# EAGLE design quadcopter (EAGLE 7.6.0)
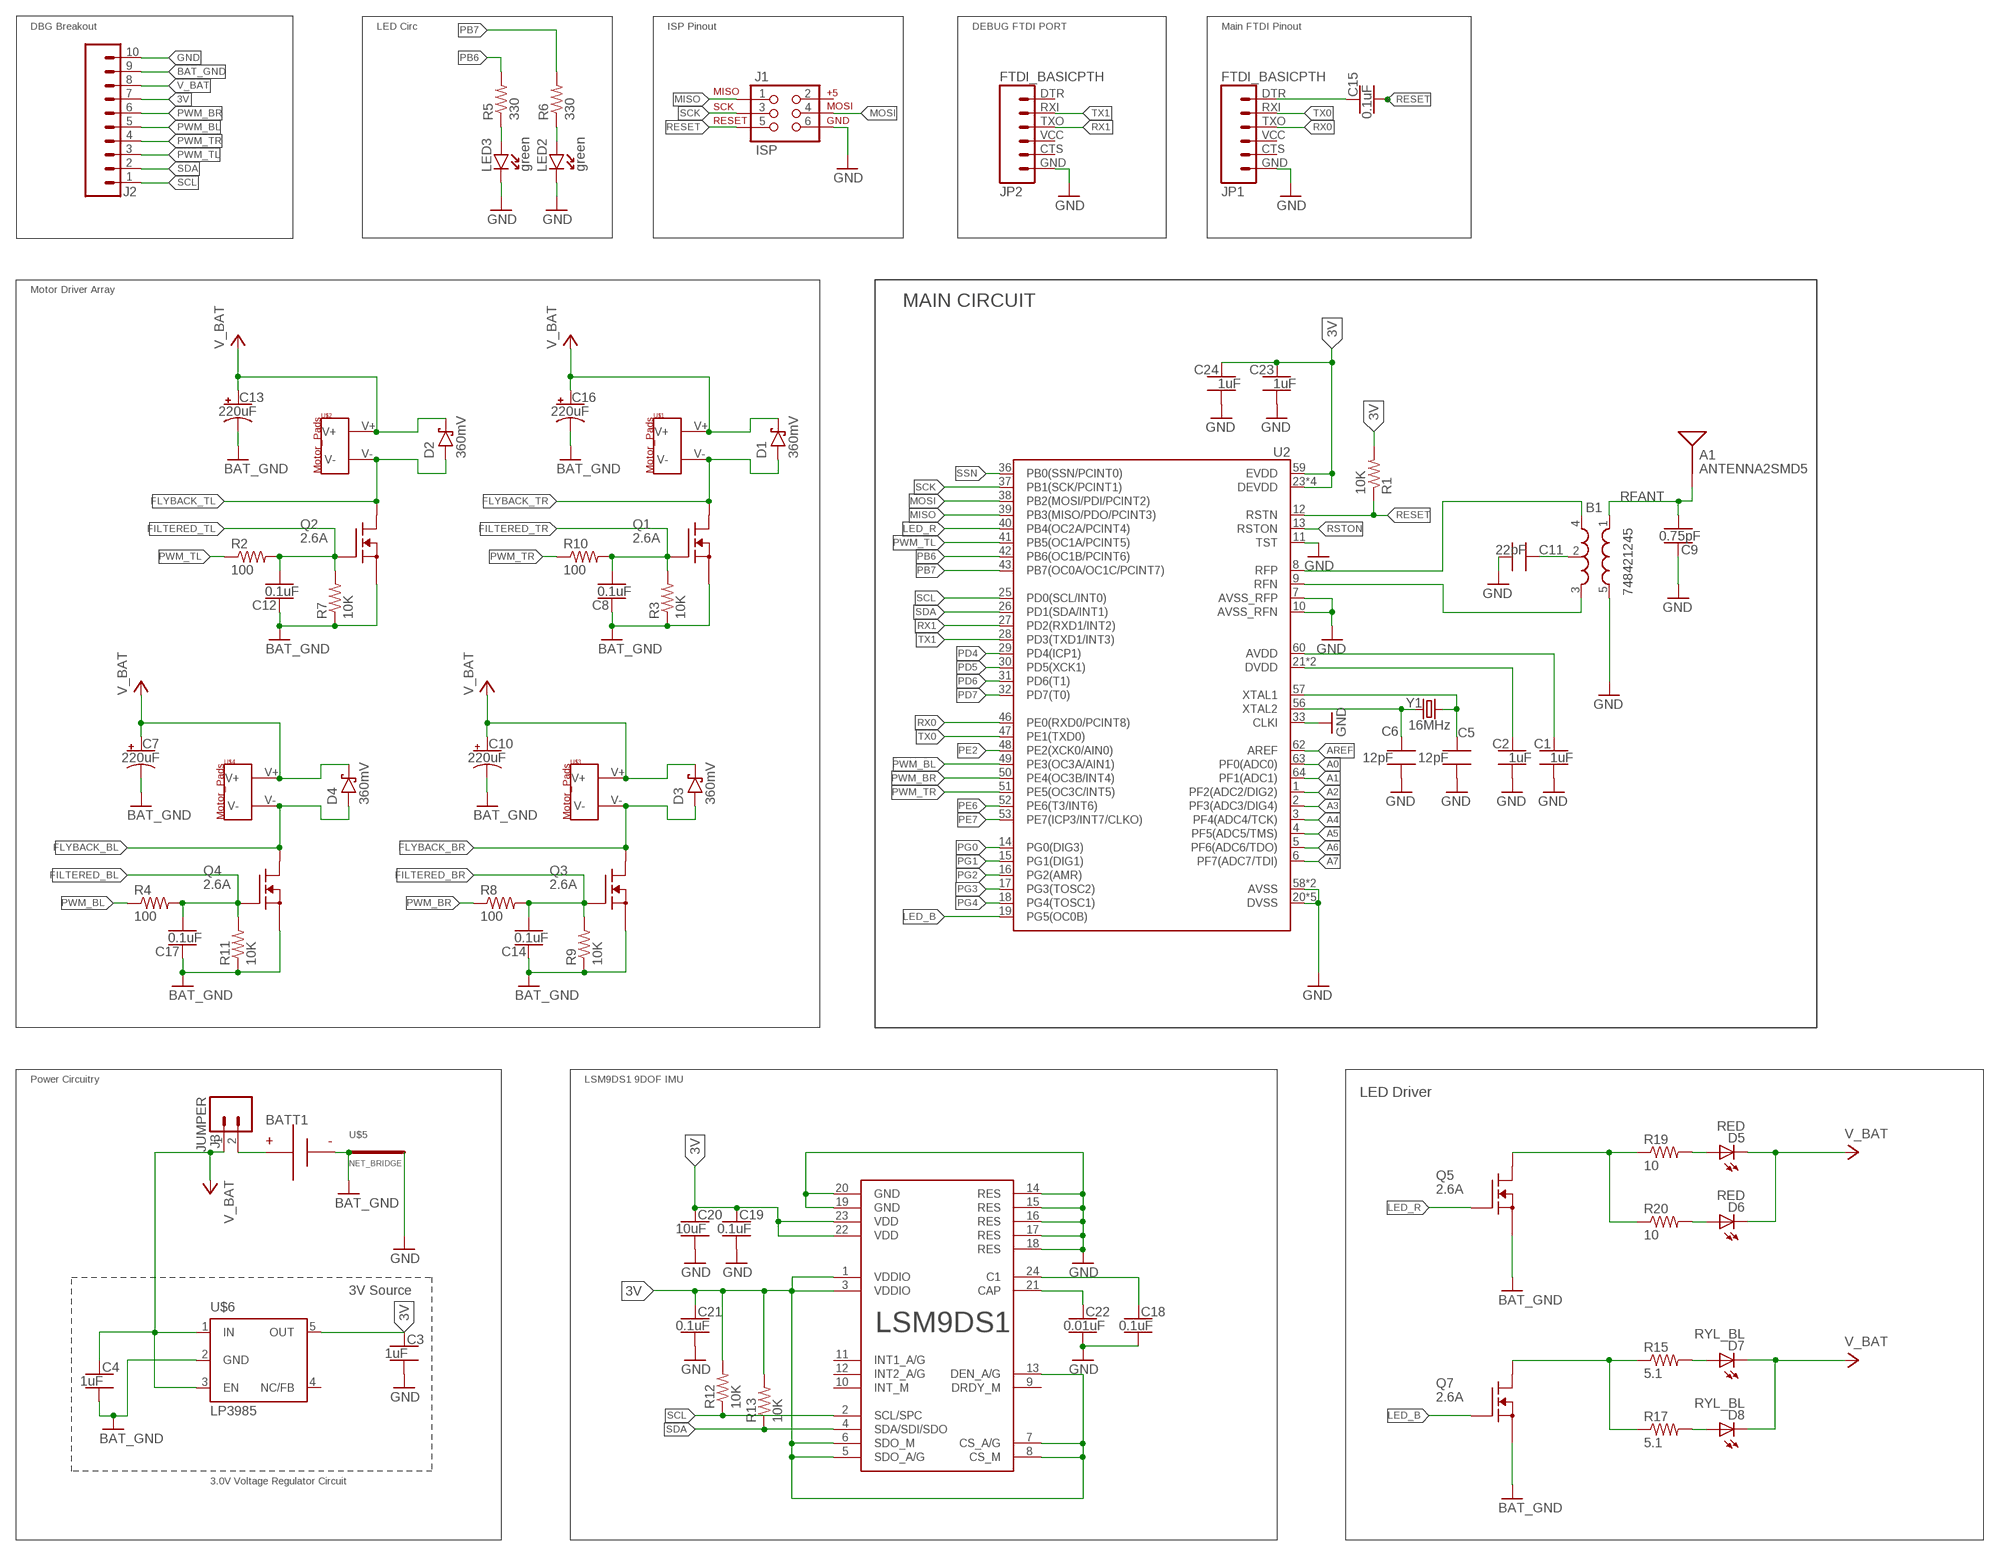
[diagram p0: schematic, sheet 1]

## Parts
A1  ANTENNA2SMD5  [ANTENNA-CHIP5]
B1  748421245  BALUN0805  [BALUN]
BATT1  BATTERY-HUBSAN-W/HOLDER  [BATTERY-W/HOLDER-380MAH-HUBSAN]
C1  1uF  CAPACITOR-NP_SMD-2012-0805_CERAMIC-1UF  [CAPC2012X140_HS]
C2  1uF  CAPACITOR-NP_SMD-2012-0805_CERAMIC-1UF  [CAPC2012X140_HS]
C3  1uF  CAPACITOR-NP_SMD-2012-0805_CERAMIC-1UF  [CAPC2012X140_HS]
C4  1uF  CAPACITOR-NP_SMD-2012-0805_CERAMIC-1UF  [CAPC2012X140_HS]
C5  12pF  CAPACITOR-NP_SMD-2012-0805_CERAMIC-12PF  [CAPC2012X140_HS]
C6  12pF  CAPACITOR-NP_SMD-2012-0805_CERAMIC-12PF  [CAPC2012X140_HS]
C7  220uF  CAPACITOR-POL_SMD-7043-D_TANTALUM-220UF  [CAPMP7343X310_HS]
C8  0.1uF  CAPACITOR-NP_SMD-2012-0805_CERAMIC-0.1UF  [CAPC2012X140_HS]
C9  0.75pF  CAPACITOR-NP_SMD-2012-0805_CERAMIC-0.75PF  [CAPC2012X140_HS]
C10  220uF  CAPACITOR-POL_SMD-7043-D_TANTALUM-220UF  [CAPMP7343X310_HS]
C11  22pF  CAPACITOR-NP_SMD-2012-0805_CERAMIC-22PF  [CAPC2012X140_HS]
C12  0.1uF  CAPACITOR-NP_SMD-2012-0805_CERAMIC-0.1UF  [CAPC2012X140_HS]
C13  220uF  CAPACITOR-POL_SMD-7043-D_TANTALUM-220UF  [CAPMP7343X310_HS]
C14  0.1uF  CAPACITOR-NP_SMD-2012-0805_CERAMIC-0.1UF  [CAPC2012X140_HS]
C15  0.1uF  CAPACITOR-NP_SMD-2012-0805_CERAMIC-0.1UF  [CAPC2012X140_HS]
C16  220uF  CAPACITOR-POL_SMD-7043-D_TANTALUM-220UF  [CAPMP7343X310_HS]
C17  0.1uF  CAPACITOR-NP_SMD-2012-0805_CERAMIC-0.1UF  [CAPC2012X140_HS]
C18  0.1uF  CAPACITOR-NP_SMD-2012-0805_CERAMIC-0.1UF  [CAPC2012X140_HS]
C19  0.1uF  CAPACITOR-NP_SMD-2012-0805_CERAMIC-0.1UF  [CAPC2012X140_HS]
C20  10uF  CAPACITOR-NP_SMD-2012-0805_CERAMIC-10UF  [CAPC2012X140_HS]
C21  0.1uF  CAPACITOR-NP_SMD-2012-0805_CERAMIC-0.1UF  [CAPC2012X140_HS]
C22  0.01uF  CAPACITOR-NP_SMD-2012-0805_CERAMIC-0.01UF  [CAPC2012X140_HS]
C23  1uF  CAPACITOR-NP_SMD-2012-0805_CERAMIC-1UF  [CAPC2012X140_HS]
C24  1uF  CAPACITOR-NP_SMD-2012-0805_CERAMIC-1UF  [CAPC2012X140_HS]
D1  360mV  DIODE-SCHOTTKY_SMD-SOD123-360MV  [SOD3716X135_HS]
D2  360mV  DIODE-SCHOTTKY_SMD-SOD123-360MV  [SOD3716X135_HS]
D3  360mV  DIODE-SCHOTTKY_SMD-SOD123-360MV  [SOD3716X135_HS]
D4  360mV  DIODE-SCHOTTKY_SMD-SOD123-360MV  [SOD3716X135_HS]
D5  RED  XQ-A-LED-RED-1616  [XQ-A-1616]
D6  RED  XQ-A-LED-RED-1616  [XQ-A-1616]
D7  RYL_BL  XQ-A-LED-RYL-BL-1616  [XQ-A-1616]
D8  RYL_BL  XQ-A-LED-RYL-BL-1616  [XQ-A-1616]
J1  ISP  AVR_SPI_PRG_6NS  [2X3-NS]
J2  SIP-10_TH-254X10  [HDRV10W63P254_10X1_2540X254H838_HS]
J3  JUMPER  MALE_HEADER_2POS-2X1-0.1IN  [MALE_HEADER_2X1_0.1IN]
JP1  FTDI_BASICPTH  [FTDI_BASIC]
JP2  FTDI_BASICPTH  [FTDI_BASIC]
LED2  green  DIODE-LED_SMD-2012-0805-GREEN  [LEDSC125X200X120-2_HS]
LED3  green  DIODE-LED_SMD-2012-0805-GREEN  [LEDSC125X200X120-2_HS]
LSM9DS1  LSM9DS1_IMU  [LSM9DS1_LGA24L]
Q1  2.6A  NMOS-SI2302CDS  [SOT-23]
Q2  2.6A  NMOS-SI2302CDS  [SOT-23]
Q3  2.6A  NMOS-SI2302CDS  [SOT-23]
Q4  2.6A  NMOS-SI2302CDS  [SOT-23]
Q5  2.6A  NMOS-SI2302CDS  [SOT-23]
Q7  2.6A  NMOS-SI2302CDS  [SOT-23]
R1  10K  RESISTOR_SMD-2012-0805-10K  [RESC2012X60_HS]
R2  100  RESISTOR_SMD-2012-0805-100  [RESC2012X60_HS]
R3  10K  RESISTOR_SMD-2012-0805-10K  [RESC2012X60_HS]
R4  100  RESISTOR_SMD-2012-0805-100  [RESC2012X60_HS]
R5  330  RESISTOR_SMD-2012-0805-330  [RESC2012X60_HS]
R6  330  RESISTOR_SMD-2012-0805-330  [RESC2012X60_HS]
R7  10K  RESISTOR_SMD-2012-0805-10K  [RESC2012X60_HS]
R8  100  RESISTOR_SMD-2012-0805-100  [RESC2012X60_HS]
R9  10K  RESISTOR_SMD-2012-0805-10K  [RESC2012X60_HS]
R10  100  RESISTOR_SMD-2012-0805-100  [RESC2012X60_HS]
R11  10K  RESISTOR_SMD-2012-0805-10K  [RESC2012X60_HS]
R12  10K  RESISTOR_SMD-2012-0805-10K  [RESC2012X60_HS]
R13  10K  RESISTOR_SMD-2012-0805-10K  [RESC2012X60_HS]
R15  5.1  RESISTOR-ERJ-6D-5.1  [PSC_RESIST_805_LR]
R17  5.1  RESISTOR-ERJ-6D-5.1  [PSC_RESIST_805_LR]
R19  10  RESISTOR-ERJ-PO6-10  [PSC_RESIST_805]
R20  10  RESISTOR-ERJ-PO6-10  [PSC_RESIST_805]
U2  ATMEGA128RFA1  [QFN-64]
U$1  MOTOR_PADS  [MOTOR_PADS]
U$2  MOTOR_PADS  [MOTOR_PADS]
U$3  MOTOR_PADS  [MOTOR_PADS]
U$4  MOTOR_PADS  [MOTOR_PADS]
U$5  NET_BRIDGE  [NET_BRIDGE]
U$6  LP3985  TPS73633-DBVT  [SOT23-DBV]
Y1  16MHz  CRYSTAL5X3  [CRYSTAL-SMD-5X3]

## Nets
3V: C3.1 C19.1 C20.1 C21.1 C23.1 C24.1 J2.7 LSM9DS1.1(VDDIO) LSM9DS1.3(VDDIO) LSM9DS1.5(SDO_A/G) LSM9DS1.6(SDO_M) LSM9DS1.7(CS_A/G) LSM9DS1.8(CS_M) LSM9DS1.13(DEN_A/G) LSM9DS1.22(VDD) LSM9DS1.23(VDD) R1.2 R12.2 R13.2 U2.23(DEVDD) U2.34(DEVDD) U2.44(DEVDD) U2.54(DEVDD) U2.59(EVDD) U$6.5(OUT)
A0: U2.63(PF0(ADC0))
A1: U2.64(PF1(ADC1))
A2: U2.1(PF2(ADC2/DIG2))
A3: U2.2(PF3(ADC3/DIG4))
A4: U2.3(PF4(ADC4/TCK))
A5: U2.4(PF5(ADC5/TMS))
A6: U2.5(PF6(ADC6/TDO))
A7: U2.6(PF7(ADC7/TDI))
AREF: U2.62(AREF)
AVDD: C1.1 U2.60(AVDD)
BAT_GND [HIGHCURRENT]: BATT1.-(N) C4.2 C7.2(-) C8.1 C10.2(-) C12.1 C13.2(-) C14.1 C16.2(-) C17.1 J2.9 Q1.S Q2.S Q3.S Q4.S Q5.S Q7.S R3.1 R7.1 R9.1 R11.1 U$5.P$1 U$6.2(GND)
DTR: C15.1 JP1.DTR
DVDD: C2.1 U2.21(DVDD) U2.22(DVDD)
FILTERED_BL: C17.2 Q4.G R4.2 R11.2
FILTERED_BR: C14.2 Q3.G R8.2 R9.2
FILTERED_TL: C12.2 Q2.G R2.2 R7.2
FILTERED_TR: C8.2 Q1.G R3.2 R10.2
FLYBACK_BL [HIGHCURRENT]: D4.A Q4.D U$4.V-
FLYBACK_BR [HIGHCURRENT]: D3.A Q3.D U$3.V-
FLYBACK_TL [HIGHCURRENT]: D2.A Q2.D U$2.V-
FLYBACK_TR [HIGHCURRENT]: D1.A Q1.D U$1.V-
GND: B1.5(GND) C1.2 C2.2 C3.2 C5.2 C6.2 C9.1 C11.2 C18.2 C19.2 C20.2 C21.2 C22.2 C23.2 C24.2 J1.6 J2.10 JP1.GND JP2.GND LED2.C LED3.C LSM9DS1.14(RES) LSM9DS1.15(RES) LSM9DS1.16(RES) LSM9DS1.17(RES) LSM9DS1.18(RES) LSM9DS1.19(GND) LSM9DS1.20(GND) U2.7(AVSS_RFP) U2.10(AVSS_RFN) U2.11(TST) U2.20(DVSS) U2.24(DVSS) U2.33(CLKI) U2.35(DVSS) U2.45(DVSS) U2.55(DVSS) U2.58(AVSS) U2.61(AVSS) U$5.P$2
LED_B: Q7.G U2.19(PG5(OC0B))
LED_R: Q5.G U2.40(PB4(OC2A/PCINT4))
MISO: J1.1 U2.39(PB3(MISO/PDO/PCINT3))
MOSI: J1.4 U2.38(PB2(MOSI/PDI/PCINT2))
N$2 [HIGHCURRENT]: BATT1.+(P) J3.2
N$3: C5.1 U2.57(XTAL1) Y1.3
N$4: C6.1 U2.56(XTAL2) Y1.1
N$5: C18.1 LSM9DS1.24(C1)
N$6 [HIGHCURRENT]: Q5.D R19.P$1 R20.P$1
N$7: B1.2(GND) C11.1
N$8: LED3.A R5.1
N$9: C22.1 LSM9DS1.21(CAP)
N$10 [HIGHCURRENT]: Q7.D R15.P$1 R17.P$1
N$11 [HIGHCURRENT]: D5.A R19.P$2
N$12 [HIGHCURRENT]: D6.A R20.P$2
N$13: LED2.A R6.1
N$15 [HIGHCURRENT]: D7.A R15.P$2
N$16 [HIGHCURRENT]: D8.A R17.P$2
PB6: R5.2 U2.42(PB6(OC1B/PCINT6))
PB7: R6.2 U2.43(PB7(OC0A/OC1C/PCINT7))
PD4: U2.29(PD4(ICP1))
PD5: U2.30(PD5(XCK1))
PD6: U2.31(PD6(T1))
PD7: U2.32(PD7(T0))
PE2: U2.48(PE2(XCK0/AIN0))
PE6: U2.52(PE6(T3/INT6))
PE7: U2.53(PE7(ICP3/INT7/CLKO))
PG0: U2.14(PG0(DIG3))
PG1: U2.15(PG1(DIG1))
PG2: U2.16(PG2(AMR))
PG3: U2.17(PG3(TOSC2))
PG4: U2.18(PG4(TOSC1))
PWM_BL: J2.5 R4.1 U2.49(PE3(OC3A/AIN1))
PWM_BR: J2.6 R8.1 U2.50(PE4(OC3B/INT4))
PWM_TL: J2.3 R2.1 U2.41(PB5(OC1A/PCINT5))
PWM_TR: J2.4 R10.1 U2.51(PE5(OC3C/INT5))
RESET: C15.2 J1.5 R1.1 U2.12(RSTN)
RFANT [RFSIG]: A1.FEED(SIGNAL) B1.1(IN) C9.2
RFN: B1.3(OUT2) U2.9(RFN)
RFP: B1.4(OUT1) U2.8(RFP)
RSTON: U2.13(RSTON)
RX0: JP1.TXO U2.46(PE0(RXD0/PCINT8))
RX1: JP2.TXO U2.27(PD2(RXD1/INT2))
SCK: J1.3 U2.37(PB1(SCK/PCINT1))
SCL: J2.1 LSM9DS1.2(SCL/SPC) R12.1 U2.25(PD0(SCL/INT0))
SDA: J2.2 LSM9DS1.4(SDA/SDI/SDO) R13.1 U2.26(PD1(SDA/INT1))
SSN: U2.36(PB0(SSN/PCINT0))
TX0: JP1.RXI U2.47(PE1(TXD0))
TX1: JP2.RXI U2.28(PD3(TXD1/INT3))
V_BAT [HIGHCURRENT]: C4.1 C7.1(+) C10.1(+) C13.1(+) C16.1(+) D1.C D2.C D3.C D4.C D5.C D6.C D7.C D8.C J2.8 J3.1 U$1.V+ U$2.V+ U$3.V+ U$4.V+ U$6.1(IN) U$6.3(EN)
Unconnected: J1.2 JP1.CTS JP1.VCC JP2.CTS JP2.DTR JP2.VCC LSM9DS1.9(DRDY_M) LSM9DS1.10(INT_M) LSM9DS1.11(INT1_A/G) LSM9DS1.12(INT2_A/G) U$6.4(NC/FB)

## Notes on the sheet
- DBG Breakout | LED Circ | ISP Pinout | DEBUG FTDI PORT | Main FTDI Pinout
- Motor Driver Array
- MAIN CIRCUIT
- Power Circuitry | LSM9DS1 9DOF IMU
- LED Driver
- 3V Source
- 3.0V Voltage Regulator Circuit

## Library data of the parts
A1 = quadparts_prebuilt:ANTENNA2: Chip antenna Single endded antenna. Common with smaller chip antennas. CHIP4 package is the GPS Chip Antenna SKU: GPS-08418. CHIP5 package is 2.4GHz chip antenna SKU: WRL-00144.; DATASHEET: http://www.linxtechnologies.com/resources/data-guides/ant-xxx-chp-x.pdf; DIST: Digikey; DISTPN: ANT-2.45-CHPCT-ND; MFR: Linx Technologies Inc.; MPN: ANT-2.45-CHP-T; PRICE: 3.16
B1 = quadparts_prebuilt:BALUN: 0805 footprint balun- Ember 351/357; DATASHEET: http://katalog.we-online.de/pbs/datasheet/748421245.pdf; DIST: Digikey; DISTPN: 732-2230-6-ND; MFR: Wurth Electronics Inc; MPN: 748421245; PRICE: 2.63
BATT1 = quadparts_prebuilt:BATTERY; CREATOR: Swanson; DIST: AMAZON; DISTPN: http://www.amazon.com/dp/B00RROB6Q4?smid=AMNTPWSAB5H0S; MFR: HUBSAN; MPN: X4-H107C-8-in-1
C1-C4 C23 C24 = quadparts_prebuilt:CAPACITOR-NP_: Nonpolarized capacitor; DIST: Digikey; DISTPN: 490-4736-1-ND; MFR: Murata Electronics North America; MPN: GRM21BR71H105KA12L
C5 C6 = quadparts_prebuilt:CAPACITOR-NP_: Nonpolarized capacitor; DIST: Digikey; DISTPN: 490-5531-1-ND; MFR: Murata Electronics North America; MPN: GRM21A5C2E120JW01D
C7 C10 C13 C16 = quadparts_prebuilt:CAPACITOR-POL_: Polarized capacitor; DIST: Digikey; DISTPN: 478-8912-1-ND; MFR: AVX Corporation; MPN: TAJD227K006RNJ
C8 C12 C14 C15 C17-C19 C21 = quadparts_prebuilt:CAPACITOR-NP_: Nonpolarized capacitor; DIST: Digikey; DISTPN: 490-1666-1-ND; MFR: Murata Electronics North America; MPN: GRM21BR71H104KA01L
C9 = quadparts_prebuilt:CAPACITOR-NP_: Nonpolarized capacitor; DIST: Digikey; DISTPN: 490-3585-1-ND; MFR: Murata Electronics North America; MPN: GQM2195C2AR75CB01D
C11 = quadparts_prebuilt:CAPACITOR-NP_: Nonpolarized capacitor; DIST: Digikey; DISTPN: 490-5534-1-ND; MFR: Murata Electronics North America; MPN: GRM21A5C2E220JW01D
C20 = quadparts_prebuilt:CAPACITOR-NP_: Nonpolarized capacitor; DIST: Digikey; DISTPN: 490-5523-1-ND; MFR: Murata Electronics North America; MPN: GRM21BR61E106KA73L
C22 = quadparts_prebuilt:CAPACITOR-NP_: Nonpolarized capacitor; DIST: Digikey; DISTPN: 490-8295-1-ND; MFR: Murata Electronics North America; MPN: GRM2195C1H103FA01D
D1-D4 = quadparts_prebuilt:DIODE-SCHOTTKY_: Schottky diode; DIST: Digikey; DISTPN: CRS08QMCT-ND; MFR: Toshiba Semiconductor and Storage; MPN: CRS08(TE85L,Q,M)
D5 D6 = LEDS:XQ-A-LED: Standard LED Packages; CREATOR: BRIAN; DIST: Digikey; DISTPN: XQARED-02-0000-000000W01CT-ND; MFR: Cree_Inc.; MPN: XQARED-02-0000-000000W01
D7 D8 = LEDS:XQ-A-LED: Standard LED Packages; CREATOR: BRIAN; DIST: Digikey; DISTPN: XQAROY-02-0000-000000601CT-ND; MFR: Cree_Inc.; MPN: XQAROY-02-0000-000000601
J1 = quadparts_prebuilt:AVR_SPI_PRG_6: AVR ISP 6 Pin This is the reduced ISP connector for AVR programming. Common on Arduino. This footprint will take up less PCB space and can be used with a 10-pin to 6-pin adapter such as SKU: BOB-08508; DATASHEET: http://portal.fciconnect.com/Comergent//fci/drawing/67996.pdf; DIST: Digikey; DISTPN: 609-3234-ND; MFR: Amphenol FCI; MPN: 67997-206HLF; PRICE: 0.31
J2 = quadparts_prebuilt:SIP-10_: 10 pin single inline pin header, socket, or connector; DATASHEET: http://portal.fciconnect.com/Comergent//fci/drawing/68000.pdf; DIST: Digikey; DISTPN: 609-3250-ND; MFR: Amphenol FCI; MPN: 68000-110HLF; PRICE: 0.55
J3 = quadparts:MALE_HEADER_2POS: 2 pin single inline pin header, socket, or connector; CREATOR: SWANSON; DIST: Digikey; DISTPN: 3M9447-ND; MFR: 3M; MPN: 961102-6404-AR
JP1 JP2 = quadparts_prebuilt:FTDI_BASIC: FTDI Basic header with labels; DATASHEET: http://portal.fciconnect.com/Comergent//fci/drawing/68015.pdf; DIST: Digikey; DISTPN: 609-3327-ND; MFR: Amphenol FCI; MPN: 68016-406HLF; PRICE: 0.33
LED2 LED3 = quadparts_prebuilt:DIODE-LED_: Light emitting diode; DIST: Digikey; DISTPN: 160-1179-1-ND; MFR: Lite-On Inc; MPN: LTST-C170GKT
LSM9DS1 = quadparts:LSM9DS1_IMU: iNEMO IMU; CREATOR: BRIAN; DIST: Digikey; DISTPN: 497-14946-1-ND; MFR: STMicroelectronics; MPN: LSM9DS1TR
Q1-Q5 Q7 = quadparts:NMOS: Vishay NMOS; CREATOR: BRIAN; DIST: Digikey; DISTPN: SI2302CDS-T1-E3CT-ND; MFR: Vishay Siliconix; MPN: SI2302CDS-T1-E3
R1 R3 R7 R9 R11-R13 = quadparts_prebuilt:RESISTOR_: Resistor; DIST: Digikey; DISTPN: 311-10KARCT-ND; MFR: Yageo; MPN: RC0805JR-0710KL
R2 R4 R8 R10 = quadparts_prebuilt:RESISTOR_: Resistor; DIST: Digikey; DISTPN: 311-100ARCT-ND; MFR: Yageo; MPN: RC0805JR-07100RL
R5 R6 = quadparts_prebuilt:RESISTOR_: Resistor; DIST: Digikey; DISTPN: 311-330ARCT-ND; MFR: Yageo; MPN: RC0805JR-07330RL
R15 R17 = quadparts:RESISTOR: General Resistors; CREATOR: BRIAN; DIST: Digikey; DISTPN: P19237CT-ND; MFR: Panasonic; MPN: ERJ-6DQJ5R1V
R19 R20 = quadparts:RESISTOR: General Resistors; CREATOR: BRIAN; DIST: Digikey; DISTPN: P10ADCT-ND; MFR: Panasonic; MPN: ERJ-P06J100V
U2 = quadparts_prebuilt:ATMEGA128RFA1: ATmega128RFA1 8-bit AVR Microcontroller with Low Power 2.4GHz Transceiver for ZigBee and IEEE 802.15.4; CREATOR: Swanson; DATASHEET: http://www.atmel.com/Images/Atmel-8266-MCU_Wireless-ATmega128RFA1_Datasheet.pdf; DIST: Digikey; DISTPN: ATMEGA128RFA1-ZUR00DKR-ND; MFR: Atmel; MPN: ATMEGA128RFA1-ZUR00; PRICE: 10.21
U$1-U$4 = quadparts_prebuilt:MOTOR_PADS; DIST: NA; DISTPN: NA; MFR: NA; MPN: NA
U$5 = quadparts:NET_BRIDGE: Used to bridge two connections without the use of a zero-ohm resistor. This model has no tStop objects, so the mask will be placed on top.; CREATOR: BRIAN; DIST: ''; DISTPN: ''; MFR: ''; MPN: ''
U$6 = quadparts_prebuilt:TPS73633-DBVT; DATASHEET: http://www.ti.com/lit/ds/symlink/lp3985.pdf; DIST: Digikey; DISTPN: LP3985IM5X-3.0/NOPBCT-ND; MFR: Texas Instruments; MPN: LP3985IM5X-3.0/NOPB; PRICE: 0.59
Y1 = quadparts_prebuilt:CRYSTAL: Various standard crystals. Proven footprints.; DATASHEET: http://www.abracon.com/Resonators/abm3b.pdf; DIST: Digikey; DISTPN: 535-9122-1-ND; MFR: Abracon LLC; MPN: ABM3B-16.000MHZ-B2-T; PRICE: 0.68; PROD_ID: XTAL-08218

## Net classes
1 RFSIG: width 0.457 mm
2 HIGHCURRENT: width 0.457 mm

## Board
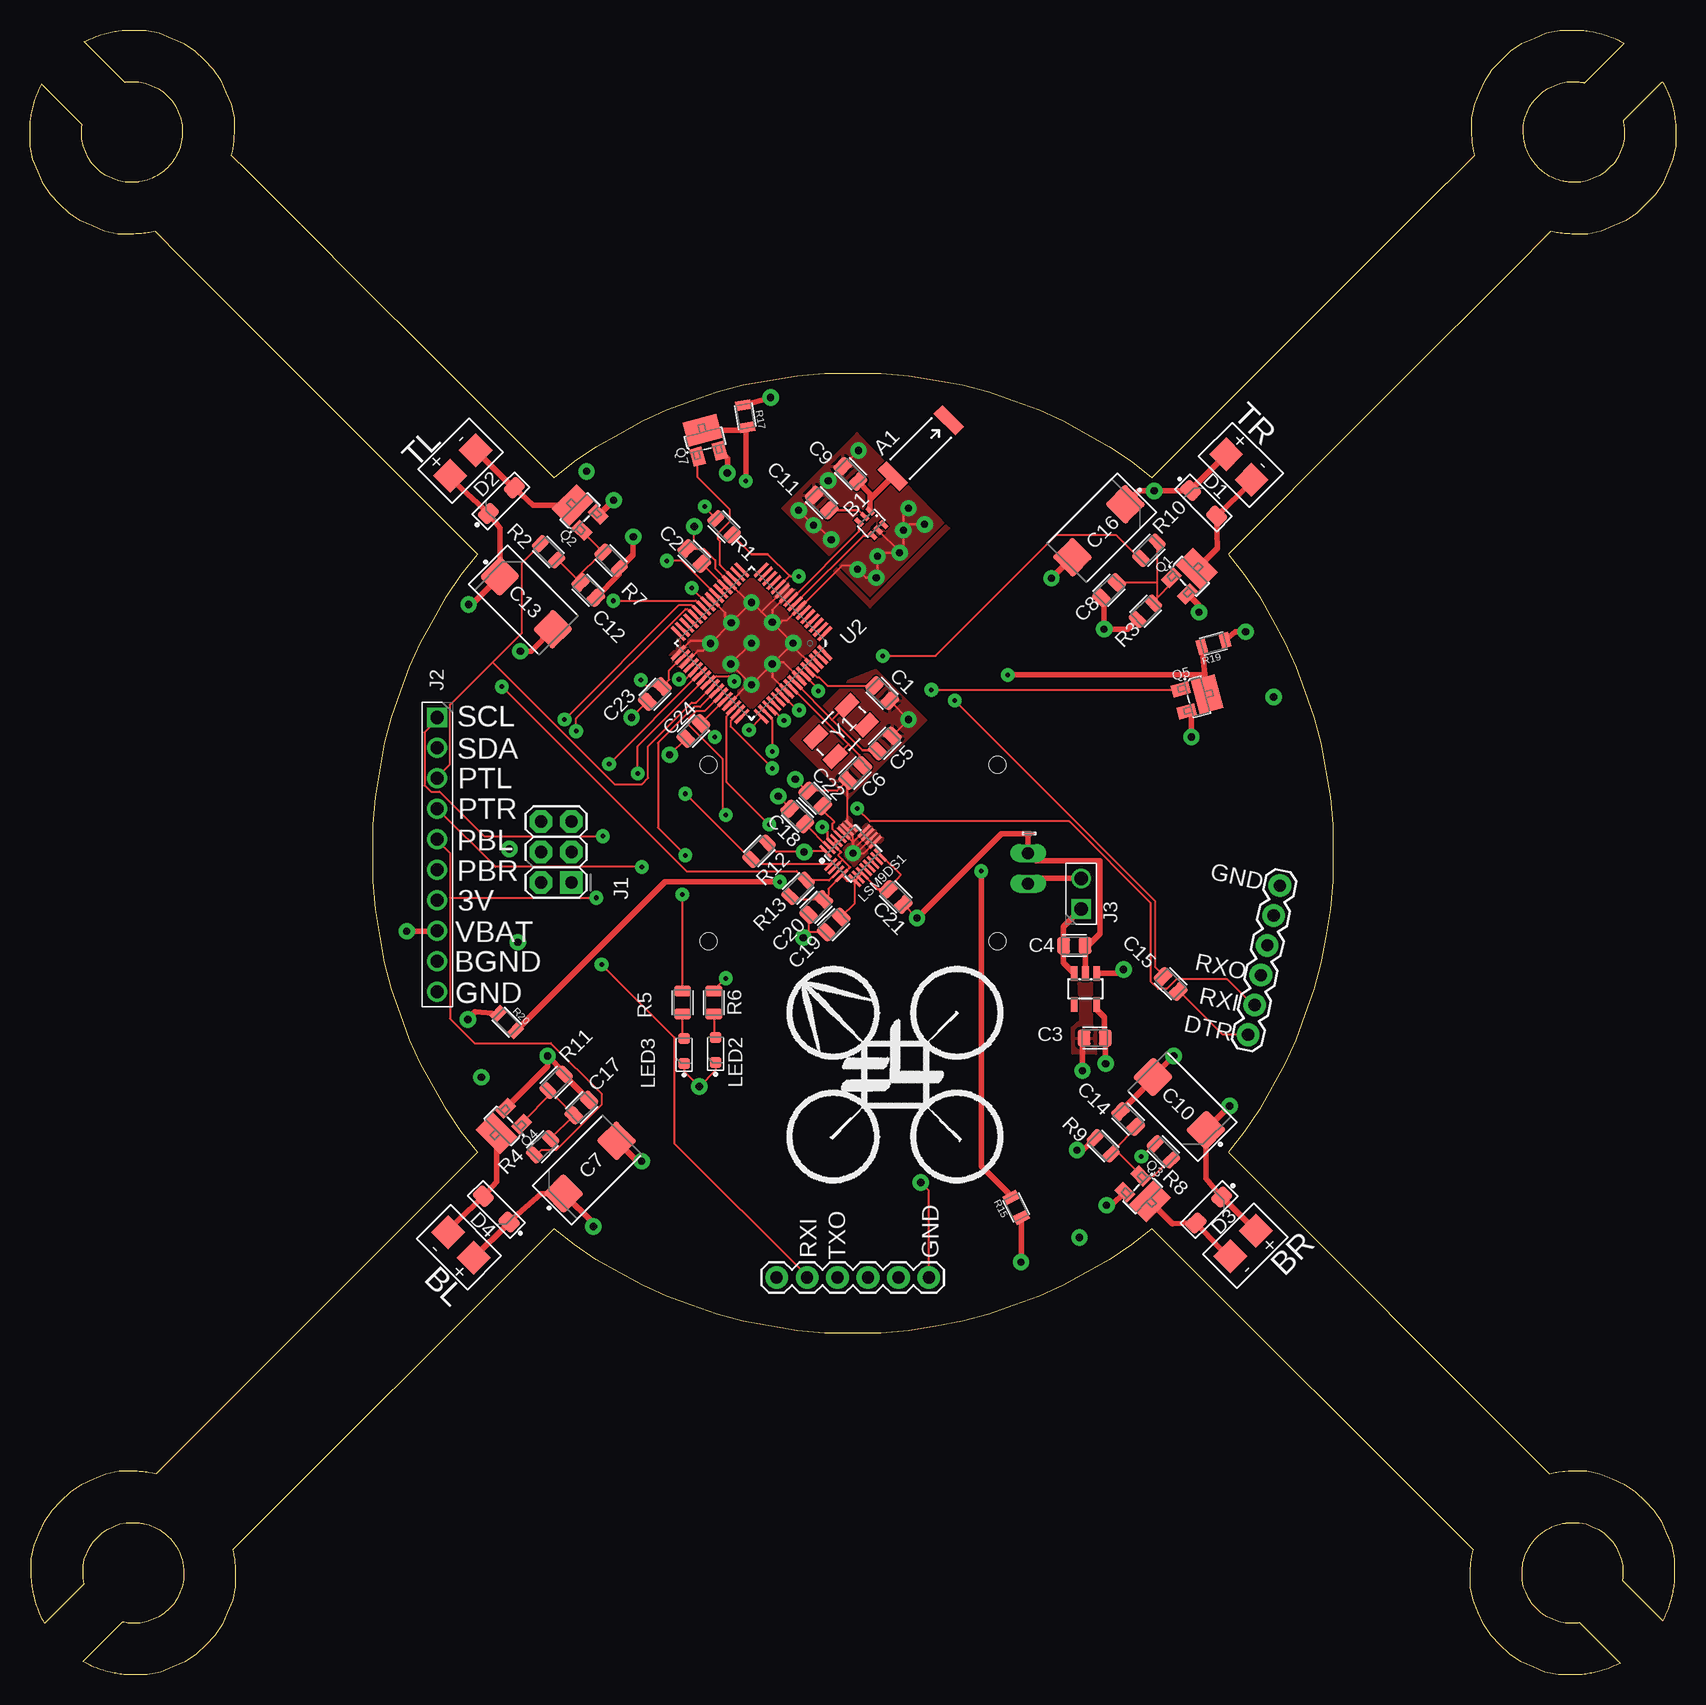
[diagram p1: board, top side]
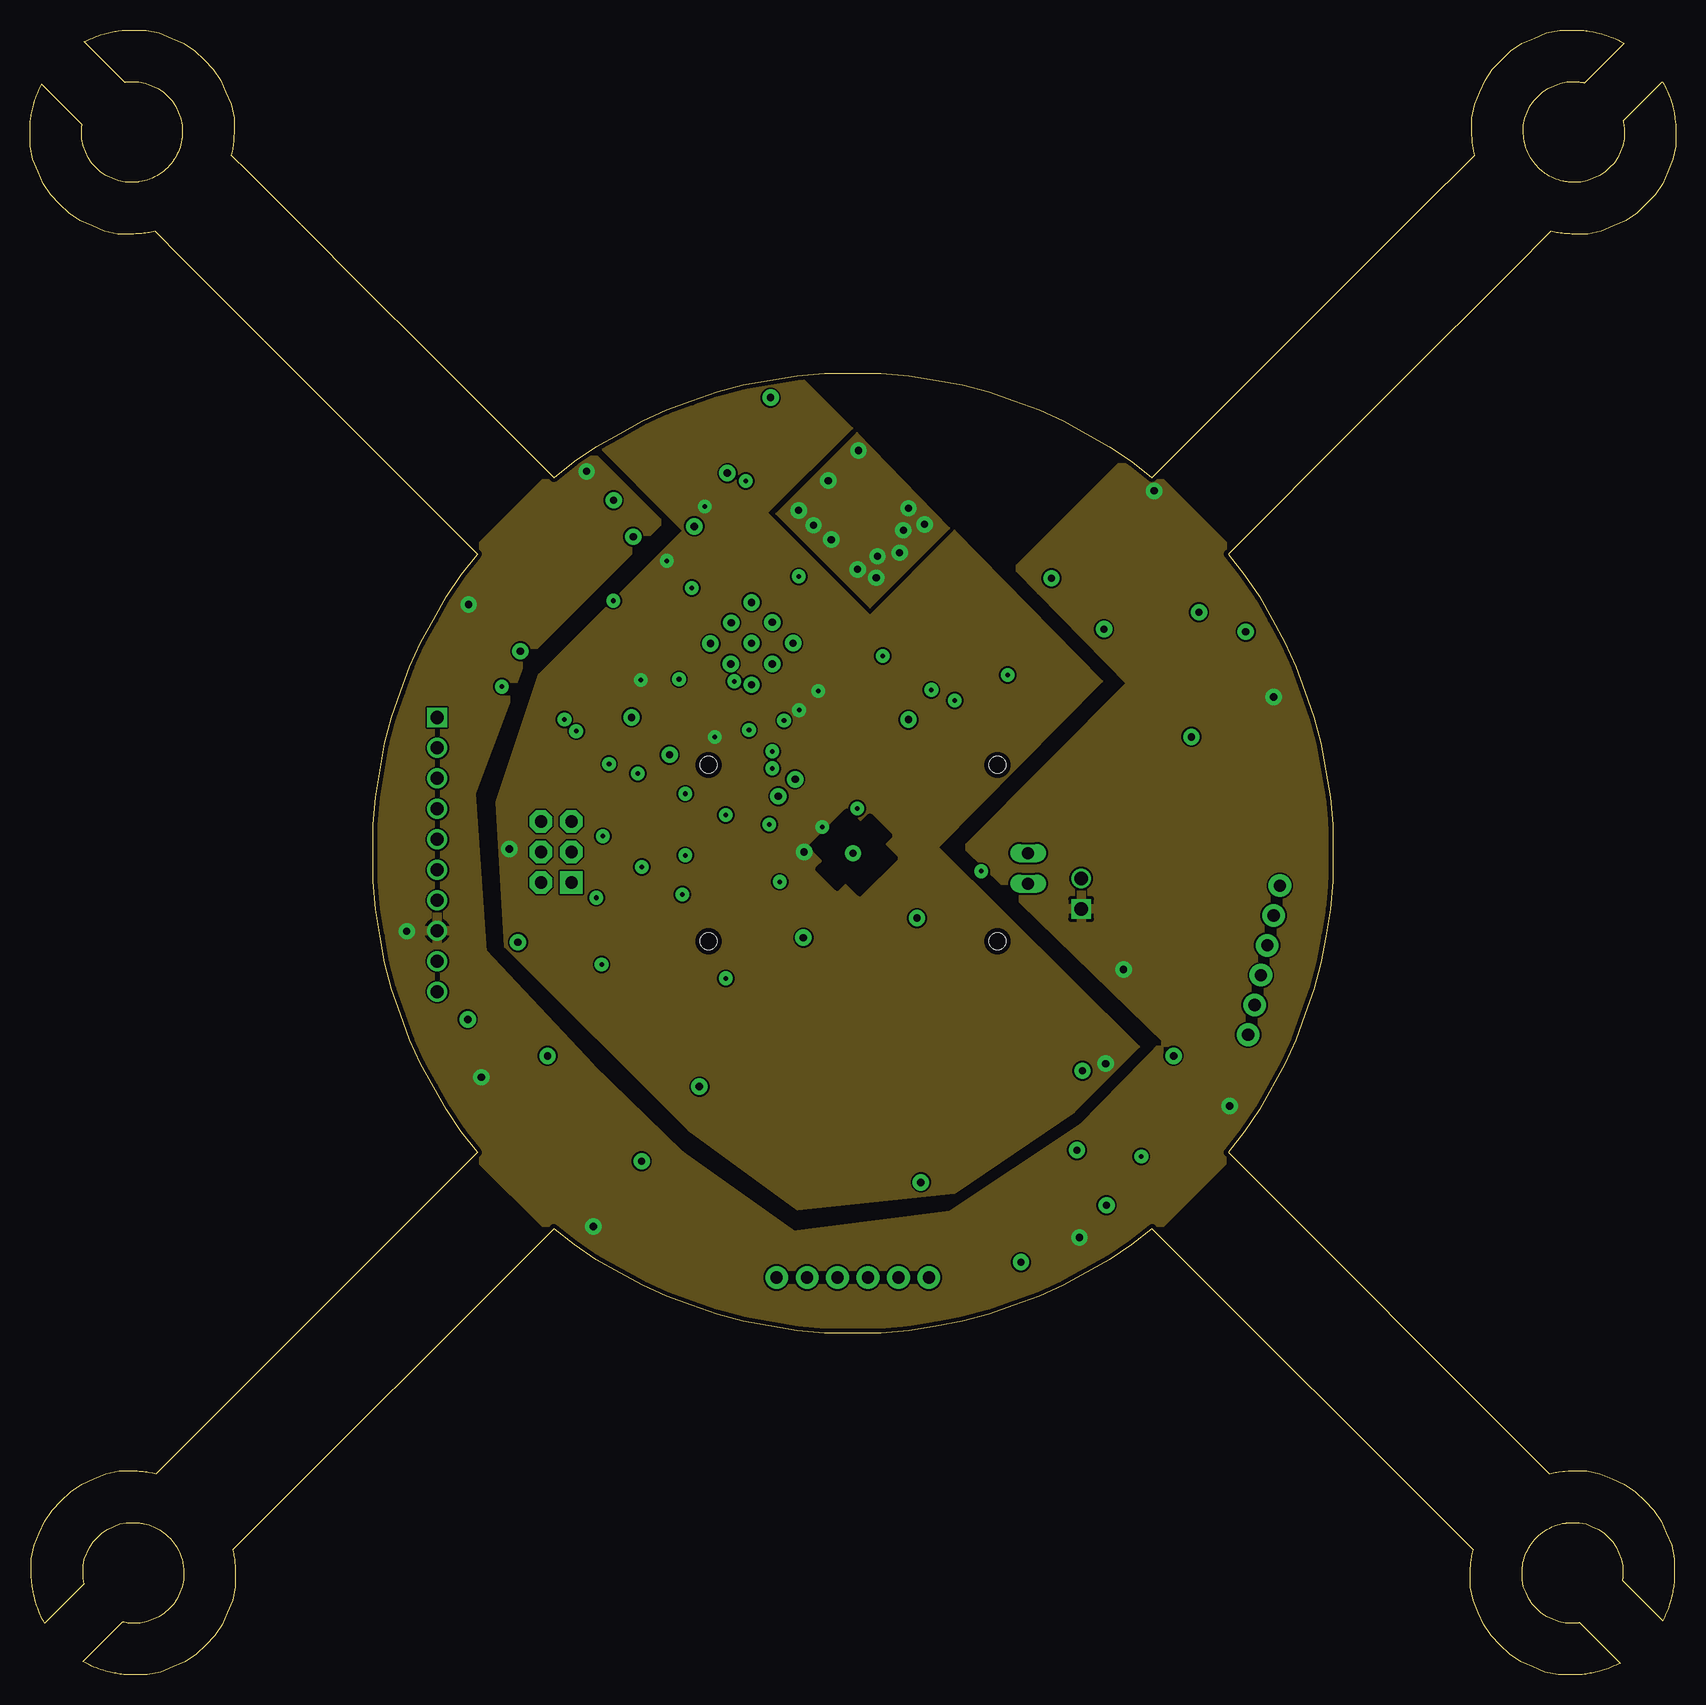
[diagram p2: board, inner layer Route2]
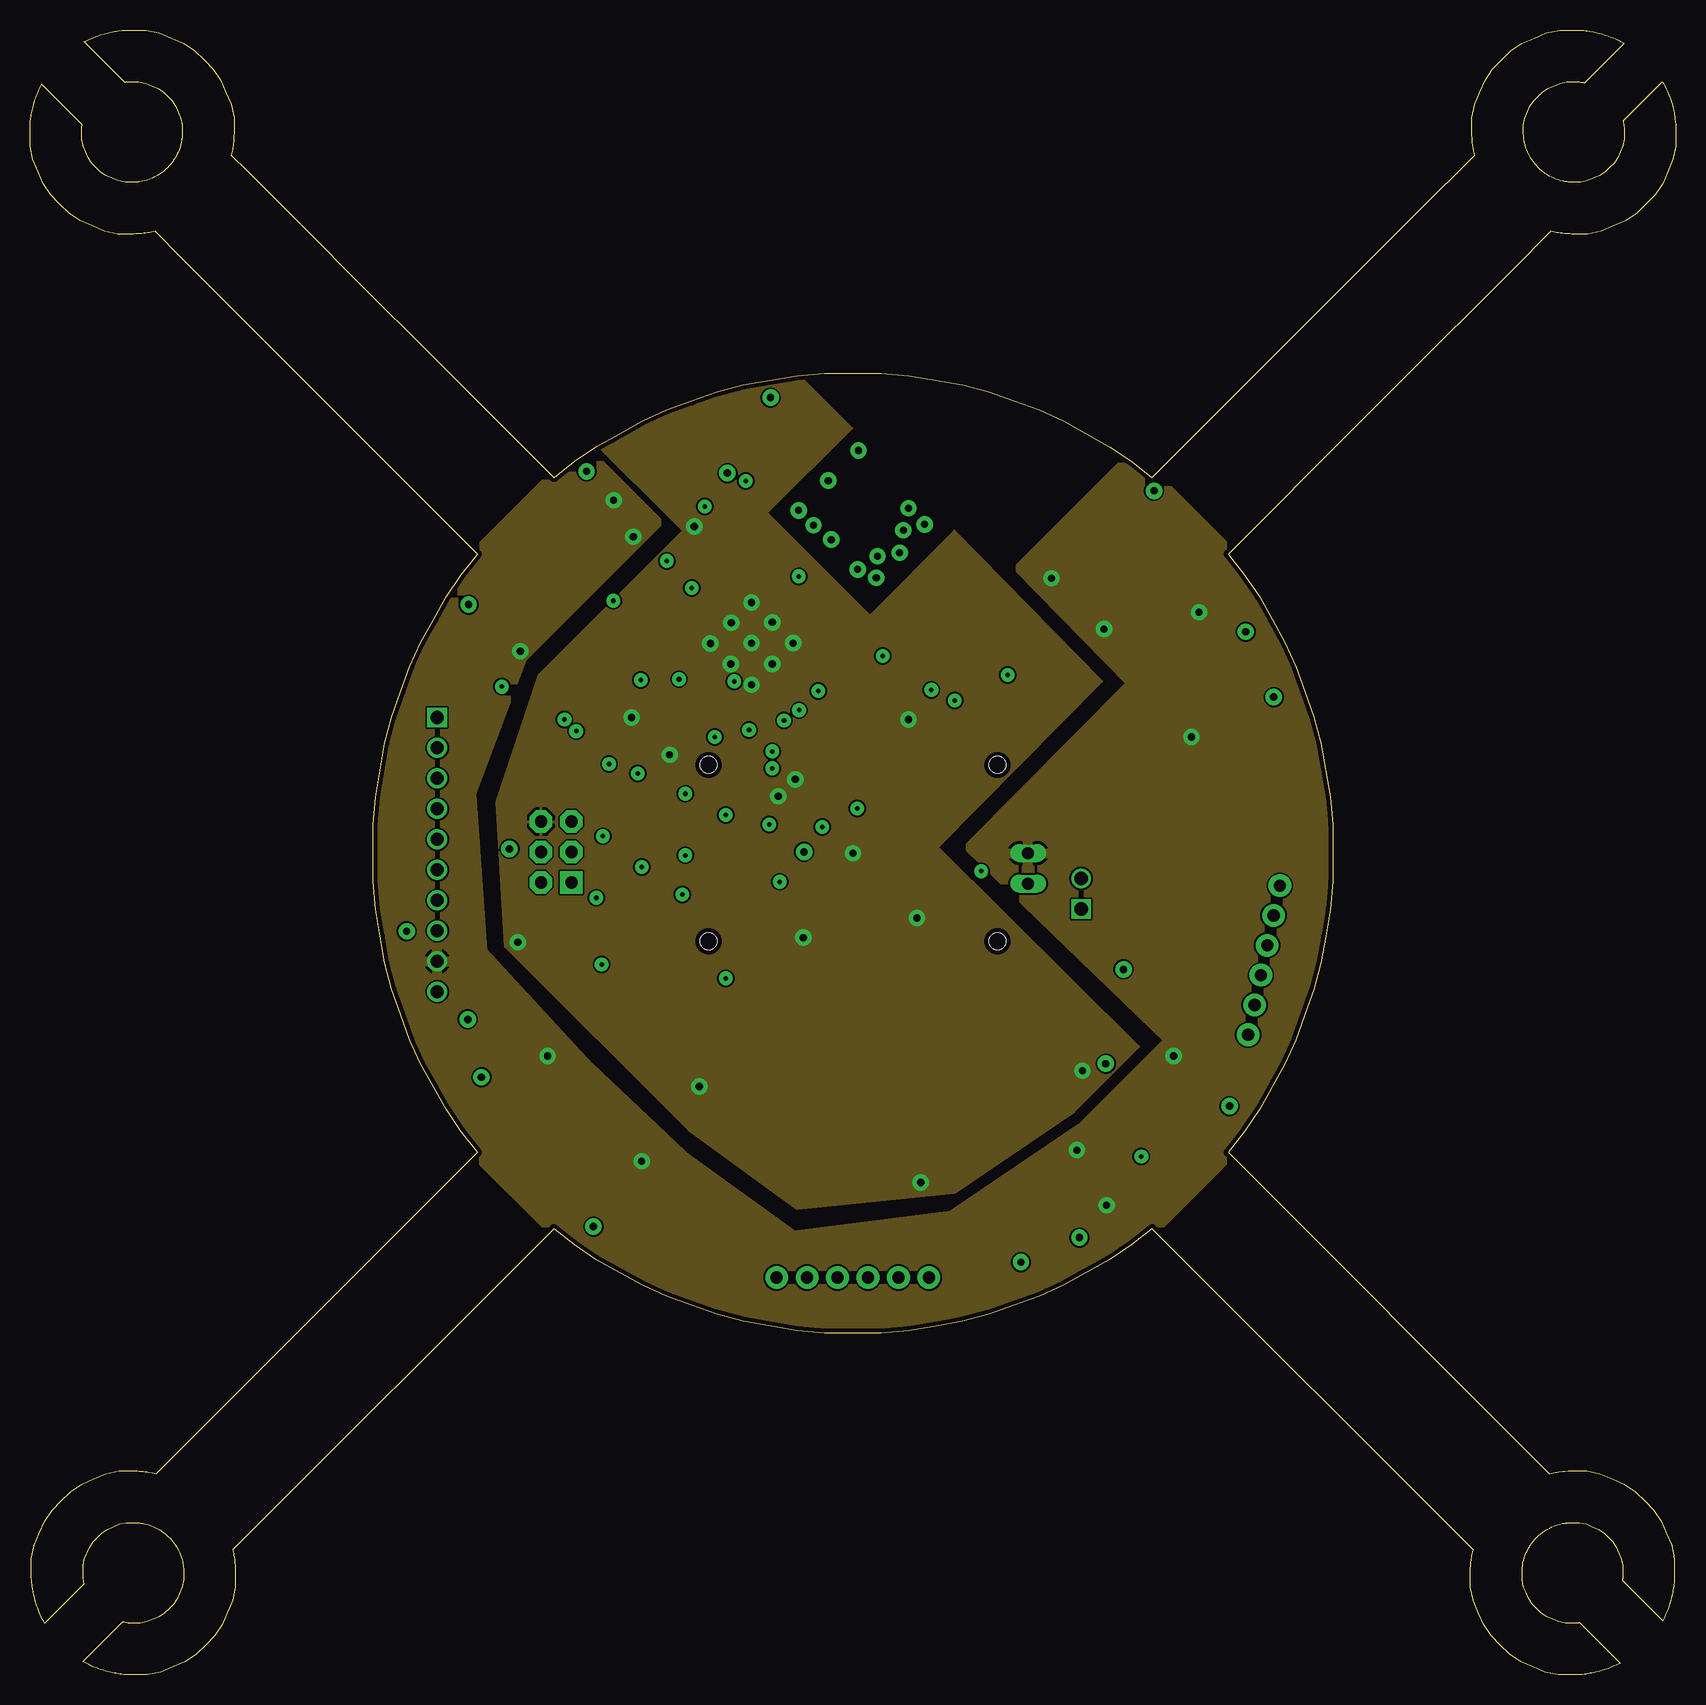
[diagram p3: board, inner layer Route15]
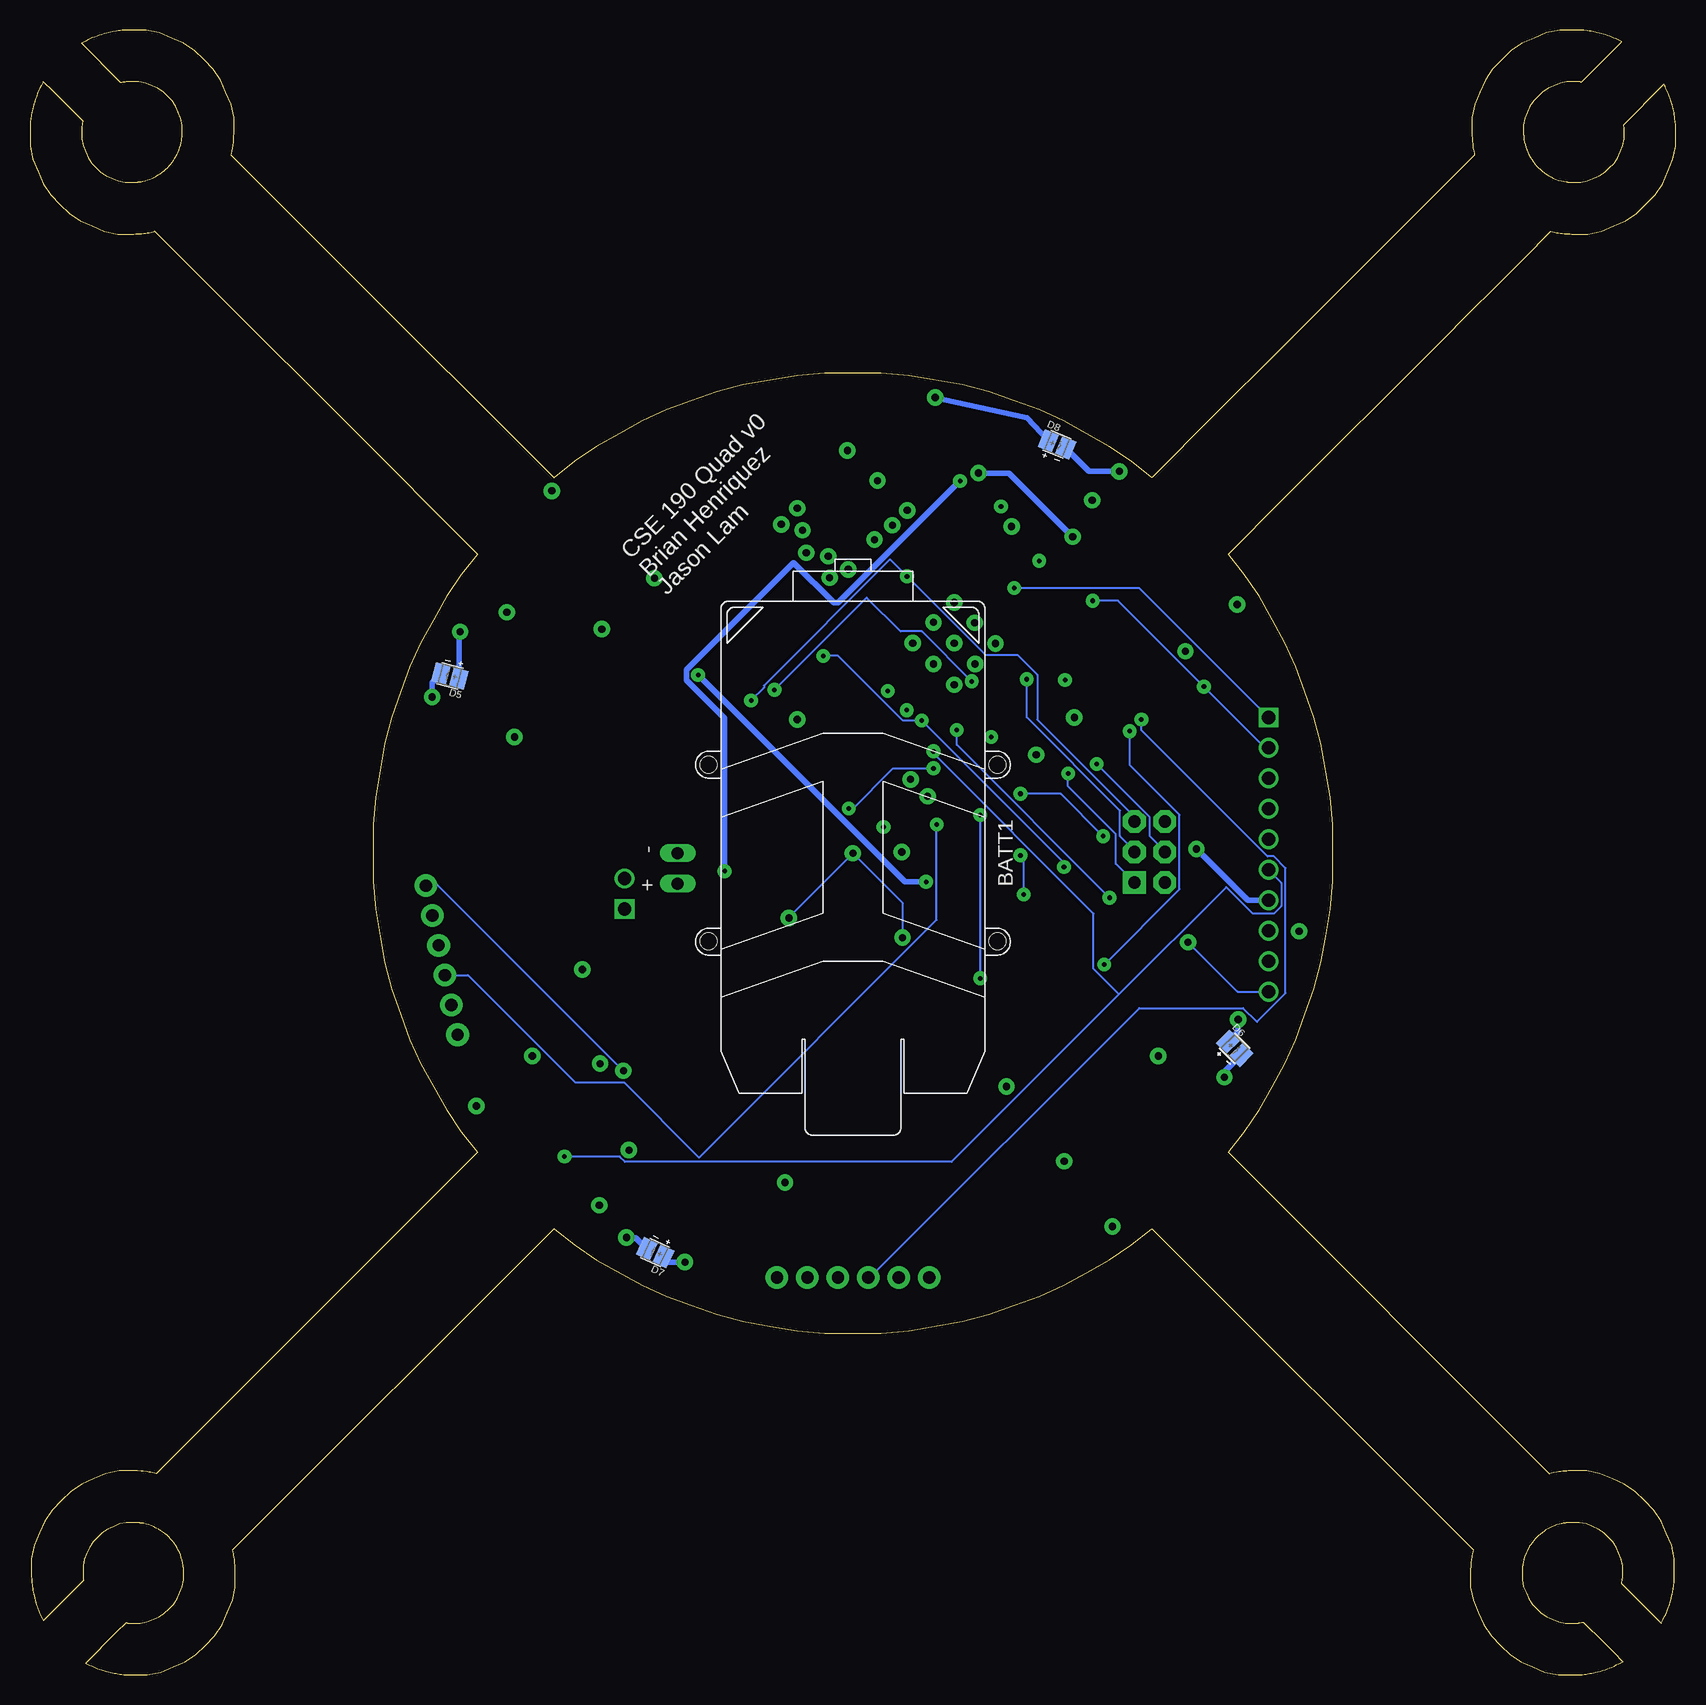
[diagram p4: board, bottom side, seen from below]

Size 137.2 x 137.08 mm. Coordinates in mm from the lower left corner, seen from the top.
Outline: 819 segments
Copper layers (1*2*15*16): Top 0.035559375mm / dielectric 1.501140625mm / Route2 0.035559375mm / dielectric 0.149859375mm / Route15 0.035559375mm / dielectric 0.200659375mm / Bottom 0.035559375mm
Design rules "4pcb-66board": minimum track width 6mil, minimum drill 15mil, track to track 6mil, track to pad 6mil, pad to pad 6mil, via to via 6mil, smd to smd 6mil, copper to edge 15mil, drill to drill 10mil, minimum pad ring 10mil, minimum via ring 15mil, stop-mask expansion 4mil, vias tented up to drill 0mil, thermal gap 10mil
tKeepout: 4 lines
tRestrict: 23 lines
bRestrict: 25 lines

### Footprints (pad centres in the part's own frame; a part is rotated, then mirrored left to right if it is on the bottom)
ANTENNA-CHIP5 = smd 1.016 x 2.54: FEED -3.302,0; NC 3.302,0
BALUN = smd 0.35 x 0.8: 1 -0.65,-0.8; 2 0,-0.8; 3 0.65,-0.8; 4 0.65,0.8; 5 0,0.8; 6 -0.65,0.8
BATTERY-W/HOLDER-380MAH-HUBSAN = drill 1 long: + -2.54,14.605; - 0,14.605 | hole 1.4: -7.35,-12.05; -7.35,12.05; 7.35,-12.05; 7.35,12.05
CAPC2012X140_HS = smd 1.08 x 1.42: 1 -0.895,0; 2 0.895,0
CAPMP7343X310_HS = smd 2.37 x 2.43: 1 -3.12,0; 2 3.12,0
SOD3716X135_HS = smd 1.6 x 1.25: A 1.565,0; C -1.465,0
XQ-A-1616 = smd 1.25 x 1.6: A 0.775,0; C -0.775,0
2X3-NS = drill 1.016 pad 1.88 square: 1 -2.54,-1.27 | drill 1.016 pad 1.88 octagon: 2 -2.54,1.27; 3 0,-1.27; 4 0,1.27; 5 2.54,-1.27; 6 2.54,1.27
HDRV10W63P254_10X1_2540X254H838_HS = drill 1.1 pad 1.65 square: 1 0,0 | drill 1.1 pad 1.65: 2 2.54,0; 3 5.08,0; 4 7.62,0; 5 10.16,0; 6 12.7,0; 7 15.24,0; 8 17.78,0; 9 20.32,0; 10 22.86,0
MALE_HEADER_2X1_0.1IN = drill 1.1 pad 1.65 square: 1 0,0 | drill 1.1 pad 1.65: 2 2.54,0
FTDI_BASIC = drill 1.016 pad 1.88: CTS 10.16,0; DTR 0,0; GND 12.7,0; RXI 2.54,0; TXO 5.08,0; VCC 7.62,0
LEDSC125X200X120-2_HS = smd 0.94 x 0.99: A 1.045,0; C -1.045,0
LSM9DS1_LGA24L = smd 0.23 x 1.35: 1 -1.505,1.725; 6 -1.505,-1.725; 7 -1.075,-1.725; 8 -0.645,-1.725; 9 -0.215,-1.725; 10 0.215,-1.725; 11 0.645,-1.725; 12 1.075,-1.725; 13 1.505,-1.725; 18 1.505,1.725; 19 1.075,1.725; 20 0.645,1.725; 21 0.215,1.725; 22 -0.215,1.725; 23 -0.645,1.725; 24 -1.075,1.725 | smd 1.35 x 0.23: 2 -1.975,0.645; 3 -1.975,0.215; 4 -1.975,-0.215; 5 -1.975,-0.645; 14 1.975,-0.645; 15 1.975,-0.215; 16 1.975,0.215; 17 1.975,0.645
SOT-23 = smd 2.9 x 2.05: D 0,2.025 | smd 1 x 1.5: G -0.95,0; S 0.95,0
RESC2012X60_HS = smd 0.92 x 1.38: 1 -0.955,0; 2 0.955,0
PSC_RESIST_805_LR = smd 0.8 x 1.25: P$1 -0.925,0; P$2 0.925,0
PSC_RESIST_805 = smd 0.8 x 1.25: P$1 -1,0; P$2 1,0
QFN-64 = smd 1.562 x 0.28: 1 -4.881,3.75; 2 -4.881,3.25; 3 -4.881,2.75; 4 -4.881,2.25; 5 -4.881,1.75; 6 -4.881,1.25; 7 -4.881,0.75; 8 -4.881,0.25; 9 -4.881,-0.25; 10 -4.881,-0.75; 11 -4.881,-1.25; 12 -4.881,-1.75; 13 -4.881,-2.25; 14 -4.881,-2.75; 15 -4.881,-3.25; 16 -4.881,-3.75; 33 4.881,-3.75; 34 4.881,-3.25; 35 4.881,-2.75; 36 4.881,-2.25; 37 4.881,-1.75; 38 4.881,-1.25; 39 4.881,-0.75; 40 4.881,-0.25; 41 4.881,0.25; 42 4.881,0.75; 43 4.881,1.25; 44 4.881,1.75; 45 4.881,2.25; 46 4.881,2.75; 47 4.881,3.25; 48 4.881,3.75 | smd 0.28 x 1.562: 17 -3.75,-4.881; 18 -3.25,-4.881; 19 -2.75,-4.881; 20 -2.25,-4.881; 21 -1.75,-4.881; 22 -1.25,-4.881; 23 -0.75,-4.881; 24 -0.25,-4.881; 25 0.25,-4.881; 26 0.75,-4.881; 27 1.25,-4.881; 28 1.75,-4.881; 29 2.25,-4.881; 30 2.75,-4.881; 31 3.25,-4.881; 32 3.75,-4.881; 49 3.75,4.881; 50 3.25,4.881; 51 2.75,4.881; 52 2.25,4.881; 53 1.75,4.881; 54 1.25,4.881; 55 0.75,4.881; 56 0.25,4.881; 57 -0.25,4.881; 58 -0.75,4.881; 59 -1.25,4.881; 60 -1.75,4.881; 61 -2.25,4.881; 62 -2.75,4.881; 63 -3.25,4.881; 64 -3.75,4.881
MOTOR_PADS = smd 2 x 2: V+ -1,0; V- 2,0
NET_BRIDGE = smd 1 x 0.2: P$1 -0.1,0; P$2 0,0
SOT23-DBV = smd 0.55 x 1.2: 1 -0.95,-1.3; 2 0,-1.3; 3 0.95,-1.3; 4 0.95,1.3; 5 -0.95,1.3
CRYSTAL-SMD-5X3 = smd 1.9 x 1.1: 1 -1.85,-1.15; 2 1.85,-1.15; 3 1.85,1.15; 4 -1.85,1.15

### Placement (x,y rotation side)
A1  74.25,102.22 45 top
B1  70.14,95.97 225 top
BATT1  68.6,68.48 90 bottom
C1  71.04,81.81 315 top
C2  55.37,93.23 135 top
C3  88.75,53.07 180 top
C4  87.05,60.77 0 top
C5  71.25,77.64 45 top
C6  68.77,75.16 225 top
C7  46.68,42.32 45 top
C8  89.95,90.4 45 top
C9  68.39,100.09 315 top
C10  95.82,47.62 135 top
C11  65.98,97.68 135 top
C12  46.54,90.4 135 top
C13  41.37,89.34 315 top
C14  91.54,46.31 315 top
C15  95.08,57.58 135 top
C16  89.1,95.35 225 top
C17  45.97,47.27 225 top
C18  63.97,71.56 135 top
C19  66.99,62.53 225 top
C20  65.52,63.99 225 top
C21  72.17,64.84 315 top
C22  65.45,73.04 135 top
C23  52.09,81.74 225 top
C24  55.3,78.66 225 top
D1  97.8,97.68 315 top
D2  39.25,97.83 45 top
D3  98.3,38.78 225 top
D4  38.9,38.78 135 top
D5  102.19,83.24 345 bottom
D6  36.78,52.22 135 bottom
D7  85.09,35.2 335 bottom
D8  51.59,102.55 157.5 bottom
J1  43.87,68.57 90 top
J2  33.95,79.79 270 top
J3  87.63,63.83 90 top
JP1  101.55,53.35 78 top
JP2  62.23,33.13 0 top
LED2  57.14,52.08 90 top
LED3  54.53,52.01 90 top
LSM9DS1  68.6,68.48 45 top
Q1  95.82,90.75 315 top
Q2  46.68,96.06 45 top
Q3  91.93,40.9 225 top
Q4  40.31,46.56 135 top
Q5  96.17,81.21 285 top
Q7  56.58,101.77 15 top
R1  57.85,95.69 135 top
R2  43.21,93.58 315 top
R3  92.99,88.63 45 top
R4  42.72,44.02 45 top
R5  54.38,56.03 90 top
R6  57,56.04 90 top
R7  48.45,92.88 135 top
R8  94.48,43.59 315 top
R9  89.46,44.09 315 top
R10  93.28,93.72 45 top
R11  43.85,49.39 225 top
R12  60.78,68.66 45 top
R13  64.04,65.55 225 top
R15  82.21,38.96 297 top
R17  59.62,104.89 100 top
R19  98.65,85.95 15 top
R20  39.75,54.4 135 top
U2  60.15,85.98 225 top
U$1  100.42,101.01 315 top
U$2  35.72,100.65 45 top
U$3  101.48,36.31 225 top
U$4  36.28,35.46 135 top
U$5  83.23,70.11 180 top
U$6  87.98,57.17 180 top
U$7  [LOGO_QUAD]  72.13,34.26 45 top
Y1  67.61,78.66 45 top

### Tracks (layer width: path | path; a pad name or v marks a point on that pad's centre or on a via)
3V  (via drill 0.38, 0.6)
  Top 0.152: 70.69,65.47 LSM9DS1.8 LSM9DS1.7 LSM9DS1.6 68.75,64.3 C19.1 | LSM9DS1.5 66.55,65.51 66.55,65.02 C20.1 63.61,64.62 R13.2 | LSM9DS1.22 LSM9DS1.23 67.54,68.63 | LSM9DS1.1 64.58,68.64 | v64.53,68.59 62.21,68.59 R12.2 | 68.35,67.31 67.75,67.92 67.36,68.3 67.61,68.55 | 68.27,67.24 LSM9DS1.5 | U2.34 53.29,83.72 53.29,82.94 C23.1 51.45,82.37 v50.92,82.91 | U2.44 C24.1 v57.07,78.17 | U2.23 54.35,92.84 v53.08,92.84 | LSM9DS1.13 72.2,67.08 72.6,66.68 C21.1
  Top 0.2: C21.1 70.69,65.47 | LSM9DS1.5 68.09,66.2 LSM9DS1.6 | LSM9DS1.23 66.48,69.68 66.48,70.25 v66.05,70.67 | 64.58,68.64 v64.53,68.59 | 67.05,67.22 LSM9DS1.3 67.07,67.24 67.75,67.92 | 68.35,67.31 68.27,67.24 | 67.61,68.55 67.54,68.63 | U2.54 63.97,80.4 v64.11,80.4 | U2.59 65.7,82.2 v65.7,81.99 | R1.2 56.26,97.29 v56.26,97.37 | C3.1 89.56,53.15 | 88.93,55.43 U$6.5
  Top 0.457: 89.56,53.15 89.56,54.8 88.93,55.43 | C3.1 89.65,50.97 v89.67,50.95
  Bottom 0.457: J2.7 35.68,64.56 v39.96,68.84
  pour Route2: 46.68,103.13 54.46,95.35 42.43,83.33 38.9,72.72 39.61,60.7 54.88,45.43 63.97,38.82 77.08,40.2 87.02,46.95 92.43,52.36 75.67,68.98 89.35,82.8 77.08,95.35 70.01,88.28 61.46,96.84 68.53,103.91 57.99,114.44
AVDD
  Top 0.152: C1.1 70.37,82.45 66.48,82.45 65.77,83.15 65.59,83.15 64.97,83.77 U2.60
BAT_GND  (via drill 0.6)
  Top 0.457: U$5.P$1 83.2,69.98 BATT1.- 83.84,67.85 89.17,67.85 89.17,61.76 88.18,60.77 C4.2 87.98,60.74 U$6.2 | C16.2 v85.14,91.39 | C8.1 89.53,89.56 v89.53,87.15 91.51,87.15 R3.1 | Q1.S 97.45,89.13 v97.45,88.56 | Q5.S 96.81,79.9 v96.81,78.17 | v95.33,51.58 95.33,51.54 C10.2 93.61,49.65 C14.1 | R9.1 87.75,43.73 v87.27,43.73 | Q3.S 90.16,39.14 v89.74,39.14 | C7.2 50.59,42.81 v50.99,42.81 | C17.1 44.52,49.98 R11.1 44.52,50.2 v43.14,51.58 43.14,50.73 Q4.S | Q2.S 47.49,96.73 v48.66,97.9 | v50.28,94.86 50.28,93.36 R7.1 49.12,91.72 C12.1 | C13.2 41.76,85.31 v40.88,85.31 | Q7.S 58.13,101.38 v58.13,100.16
  Bottom 0.457: v50.28,94.86 55.59,100.16 v58.13,100.16
  pour Route15: 12.06,68.45 46.01,102.39 52.33,96.06 41.02,84.74 36.78,73.43 37.7,60.35 46.64,50.63 54.35,43.34 63.65,36.66 76.8,38.29 87.76,45.71 94.94,52.89 78.29,68.98 91.83,82.66 84.26,90.37 82.46,92.24 91.93,101.72 125.17,68.48 68.6,11.91
DTR
  Top 0.152: C15.1 95.82,56.99 99.45,53.37 101.39,53.37 JP1.DTR
DVDD
  Top 0.152: C2.1 U2.21 U2.22
FILTERED_BL
  Top 0.152: R4.2 43.41,44.71 45.26,46.56 C17.2 45.35,46.65 43.5,48.51 | 43.5,48.51 43.32,48.68 R11.2 43.5,48.51 | 43.5,48.51 41.02,46.03 Q4.G
FILTERED_BR
  Top 0.152: 90.43,43.82 92.2,45.59 C14.2 | 90.43,43.82 90.16,43.56 R9.2 90.43,43.82 | R8.2 95.03,42.94 93.7,41.61 92.64,41.61 Q3.G 92.55,41.7 90.43,43.82
FILTERED_TL
  Top 0.152: Q2.G 46.06,95.26 47.74,93.58 R7.2 47.65,93.5 45.53,91.37 | 45.53,91.37 45.88,91.02 C12.2 45.53,91.37 | 45.53,91.37 44.03,92.88 R2.2
FILTERED_TR
  Top 0.152: 93.96,89.78 95.11,90.93 95.11,91.29 Q1.G | 93.96,89.78 93.61,89.43 R3.2 | 93.96,89.78 93.96,91.02 | 93.96,91.02 93.96,94.38 R10.2 | 93.96,91.02 90.61,91.02 C8.2
FLYBACK_BL
  Top 0.457: U$4.V- 34.87,37.11 D4.A 38.88,41.12 Q4.D
FLYBACK_BR
  Top 0.457: Q3.D 95.23,37.61 D3.A 99.83,34.89 U$3.V-
FLYBACK_TL
  Top 0.457: U$2.V- 40.2,99 D2.A 41.94,97.49 Q2.D
FLYBACK_TR
  Top 0.457: Q1.D 98.98,93.91 D1.A 101.83,99.36 U$1.V-
GND  (via drill 0.6)
  Top 0.152: LSM9DS1.20 68.6,69.39 LSM9DS1.17 | LSM9DS1.14 69.51,68.48 v68.6,68.48 68.6,70 LSM9DS1.19 LSM9DS1.18 | 68.9,68.48 LSM9DS1.15 | 68.6,68.79 LSM9DS1.16 | C19.2 64.92,61.9 | C20.2 64.89,61.87 | 62.23,87.36 62.73,87.86 63.08,87.86 U2.7 67.68,92.45 68.67,92.45 v68.99,92.13 | C23.2 v50.14,79.8 | C24.2 v53.32,76.68 | C2.2 55.37,94.5 v55.37,95.71 | 54.77,93.83 56.19,93.83 57.11,92.91 57.11,92.2 U2.20 | 68.14,71.07 C6.2 67.29,73.68 C22.2 | JP2.GND 74.93,40.37 v74.25,41.05 | LED3.C 54.53,50.31 v55.8,49.04 57.14,50.38 LED2.C | U2.45 58.34,81.03 59.94,82.62 v60.15,82.52
  Top 0.2: C1.2 v73.23,79.62 C5.2 | C22.2 64.85,73.57 v63.79,74.63 | C18.2 63.44,72.15 v62.37,73.22 | v68.6,68.48 68.9,68.48 | v68.6,68.48 68.6,68.79 | v68.6,68.48 68.6,69.39 | C21.2 v73.94,63.07 | 64.92,61.9 v64.46,61.45 64.89,61.87 | U2.33 55.06,86.19 56.47,86.19 v56.72,85.95 | U2.35 54.82,84.48 55.69,85.35 56.12,85.35 v56.72,85.95 | v58.45,87.68 v56.72,85.95 | v58.45,87.68 v60.15,89.38 | v60.15,89.38 60.22,89.38 61,88.6 | 61,88.6 v61.88,87.71 | v61.88,87.71 61.88,88.78 U2.10 | v63.61,85.98 62.23,87.36 v61.88,87.71 | v61.88,84.25 v63.61,85.98 | v61.88,84.25 v60.15,82.52 v58.42,84.25 v60.15,85.98 | v63.61,85.98 63.61,85.7 U2.61 | v60.15,89.38 59.94,89.38 U2.20 | U2.24 57.96,88.53 57.96,88.17 v58.45,87.68 | U2.55 61.92,83.15 61.92,84.21 v61.88,84.25 | U2.58 62.8,84.39 62.02,84.39 v61.88,84.25 | U2.11 61,88.6 | v69.06,102.03 C9.1 67.75,100.72 v66.55,99.52 C11.2 64.08,97.05 v64.07,97.05 v65.31,95.81 65.59,95.81 v66.79,94.61 | v68.99,92.13 69.69,91.43 v70.54,91.43 70.65,91.53 v70.65,93.23 70.93,93.51 v72.49,93.51 | v72.49,93.51 72.8,93.83 v72.8,95.39 | v72.8,95.39 73.3,95.88 v74.57,95.88 | v73.23,97.23 72.8,96.8 v72.8,95.39 | B1.5 72.49,93.63 v72.49,93.51 | C2.2 54.77,93.83 | LSM9DS1.18 68.14,71.07 | C3.2 87.72,52.94
  Top 0.457: 87.72,52.94 v87.72,50.34 | v73.94,63.07 80.97,70.11 U$5.P$2
  Bottom 0.152: 73.94,63.14 v68.6,68.48 64.46,64.34 v64.46,61.45 | v40.67,61.06 36.55,56.94 J2.10 | v87.72,50.34 87.78,50.36 103.25,65.83 104.13,65.83 JP1.GND
  Bottom 0.2: 73.94,63.14 v73.94,63.07
  pour Top: 63.26,77.85 68.24,82.84 70.65,83.83 74.93,79.55 68.24,72.87
  pour Top: 62.23,96.77 68.95,103.48 76.59,95.56 70.01,88.99
  pour Top: 65.56,69.05 68.1,71.59 69.27,70.43 69.98,71.13 71.28,69.82 70.54,69.08 71.71,67.92 69.2,65.41 68,66.61 67.29,65.9 66.02,67.17 66.72,67.88 65.59,69.01
  pour Top: 53.32,84.74 54.53,85.95 53.25,87.22 58.98,92.95 60.25,91.67 61.46,92.88 61.53,92.81 61.46,92.73 66.97,87.22 65.77,86.02 67.11,84.67 61.53,79.09 60.18,80.43 58.91,79.16
  pour Route2: 62.23,96.77 68.95,103.48 76.59,95.56 70.01,88.99
  pour Top: 87.48,56.32 87.3,59.61 86.74,59.61 86.66,61.94 89.03,62.12 89.17,59.64 88.4,59.64 88.36,59.25 88.5,57.7 88.5,54.02 88.89,53.84 88.86,51.76 86.88,51.83 86.84,53.91 87.55,54.55
  pour Route15: 57.99,114.44 46.64,103.09 54.46,95.35 42.43,83.33 38.9,72.72 39.61,60.7 54.88,45.43 63.93,38.85 77.08,40.2 87.02,46.95 92.43,52.36 75.67,68.98 89.35,82.8 77.08,95.35 70.01,88.28 61.46,96.84 68.53,103.91
LED_B
  Top 0.152: U2.19 57.53,92.49 57.53,94.47 57.35,94.64 57.35,95.14 58.34,96.13 58.34,97.12 55.66,99.8 Q7.G
LED_R  (via drill 0.38)
  Top 0.152: v75.14,82.09 95.82,82.09 Q5.G | v58.7,82.8 58.26,83.24 57.2,83.24 56.67,82.71 U2.40
  Bottom 0.152: v75.14,82.09 67.45,89.78 64.62,86.95 62.85,86.95 v58.7,82.8
MISO  (via drill 0.38)
  Top 0.152: v50.65,75.11 50.65,77.41 56.22,82.98 U2.39
  Bottom 0.152: v50.65,75.11 50.65,74.05 46.68,70.07 46.68,67.6 45.17,66.1 J1.1
MOSI  (via drill 0.38)
  Top 0.152: v48.27,75.91 55.78,83.42 U2.38
  Bottom 0.152: v48.27,75.91 43.85,71.49 43.85,69.9 42.61,68.66 J1.4
N$1
  cutout Route2: 65.66,67.17 66.34,67.84 65.13,69.05 68.07,71.98 69.23,70.81 70.01,71.59 71.67,69.93 70.97,69.22 72.13,68.06 69.16,65.09 68,66.25 67.29,65.55
N$2
  Top 0.457: BATT1.+ 83.64,66.38 J3.2
N$3
  Top 0.2: U2.57 66.87,79.62 | 66.87,79.62 69.41,77.07 70.55,77.07 C5.1 | Y1.3 68.03,80.79 66.87,79.62
N$4
  Top 0.2: U2.56 68.21,77.57 | 68.21,77.57 69.13,76.65 69.13,76.08 C6.1 | Y1.1 67.18,76.54 68.21,77.57
N$5
  Top 0.152: 66.58,68.94 C18.1
  Top 0.2: LSM9DS1.24 66.58,68.94
N$6  (via drill 0.38)
  Top 0.457: Q5.D 97.95,83.35 | 97.95,83.35 R19.P$1 | v62.5,66.1 52.95,66.1 40.58,53.72 R20.P$1 | v81.5,83.33 97.77,83.33 97.95,83.35
  Bottom 0.457: v62.5,66.1 64.27,66.1 v81.5,83.33
N$7
  Top 0.2: B1.2 69.06,97.05 C11.1
N$8
  Top 0.152: LED3.A 54.54,53.19 54.37,53.37 54.37,54.96 R5.1
N$9
  Top 0.152: 66.19,71.95 67.04,71.1 66.9,70.96 66.9,70.46 67.51,69.85
  Top 0.2: 67.53,69.9 LSM9DS1.21 67.51,69.85 | C22.1 66.19,72.02 66.19,71.95
N$10  (via drill 0.38)
  Top 0.457: Q7.D 59.53,103.73 R17.P$1 59.67,103.57 v59.67,99.51 | v79.29,66.98 79.29,42.41 81.77,39.93 R15.P$1
  Bottom 0.457: v79.29,66.98 79.29,79.71 82.47,82.89 82.47,83.77 73.55,92.7 70.19,89.34 69.83,89.34 v59.67,99.51
N$11  (via drill 0.6)
  Top 0.457: R19.P$2 100.49,86.94 v101.34,86.94
  Bottom 0.457: v101.34,86.94 101.44,86.84 D5.A
N$12  (via drill 0.6)
  Top 0.457: v36.49,54.62 37.12,55.25 R20.P$2
  Bottom 0.457: D6.A 36.49,53.6 v36.49,54.62
N$13
  Top 0.152: LED2.A 57.2,53.19 57.02,53.37 57.02,54.96 R6.1
N$15  (via drill 0.6)
  Top 0.457: v82.6,34.4 82.63,34.43 R15.P$2
  Bottom 0.457: D7.A 83.91,34.4 v82.6,34.4
N$16  (via drill 0.6)
  Top 0.457: v61.74,106.45 R17.P$2
  Bottom 0.457: D8.A 54.1,104.76 v61.74,106.45
PB6  (via drill 0.38)
  Top 0.152: v54.37,65.03 54.37,57.08 R5.2 | v54.63,68.3 52.33,70.6 52.33,77.67 55.34,80.68 55.87,80.68 57.2,82 U2.42
  Bottom 0.152: v54.37,65.03 54.37,68.04 v54.63,68.3
PB7  (via drill 0.38)
  Top 0.152: v57.99,58.05 57.02,57.08 R6.2 | v57.99,71.66 57.73,71.93 57.73,76.35 54.9,79.18 54.9,79.71 55.52,80.33 56.22,80.33 57.55,81.65 U2.43
  Bottom 0.152: v57.99,71.66 v57.99,58.05
PWM_BL  (via drill 0.38)
  Top 0.152: 35.01,64.77 35.01,68.48 33.95,69.54 J2.5 | 35.01,64.77 35.01,54.69 37.04,52.66 43.41,52.66 47.65,48.42 47.65,47.53 43.85,43.73 42.61,43.73 42.17,43.29 R4.1 | v59.94,78.73 61,79.8 U2.49 | 35.01,64.77 v47.21,64.77
  Bottom 0.152: v59.94,78.73 59.94,77.5 v47.21,64.77
PWM_BR  (via drill 0.38)
  Top 0.152: v92.64,43.2 93.7,44.26 R8.1 | v61.88,76.97 61.88,79.62 61.35,80.15 U2.50
  Bottom 0.152: v92.64,43.2 88.04,43.2 87.6,42.76 60.38,42.76 46.41,56.73 | 46.41,56.73 37.48,65.65 35.28,63.44 33.51,63.44 32.89,64.06 32.89,66.01 33.95,67.07 J2.6 | v61.88,76.97 61.88,76.79 48.53,63.44 48.53,58.85 46.41,56.73
PWM_TL
  Top 0.152: 38.55,84.39 35.01,80.86 35.01,75.91 33.95,74.85 J2.3 | 38.55,84.39 41.02,86.87 41.02,92.7 42.52,94.2 R2.1 | 38.55,84.39 48.71,74.23 51.01,74.23 51.54,74.76 51.54,77.41 55.16,81.03 55.52,81.03 56.84,82.36 U2.41
PWM_TR  (via drill 0.38)
  Top 0.152: v71.07,84.92 75.49,84.92 85.57,95 90.52,95 92.46,93.05 R10.1 | v62.85,79.53 61.79,80.59 U2.51 | v51.01,67.33 38.81,67.33 34.04,72.11 J2.4
  Bottom 0.152: v71.07,84.92 69.83,84.92 64.44,79.53 v62.85,79.53 51.01,67.69 v51.01,67.33
RESET  (via drill 0.38)
  Top 0.152: v77.08,81.21 93.79,64.5 93.79,59.02 94.5,58.32 C15.2 | v64.09,91.55 63.38,91.55 63.29,91.6
  Top 0.2: R1.1 60.14,93.41 61.49,93.41 63.29,91.6 U2.12
  Bottom 0.152: v77.08,81.21 76.02,82.27 76.02,82.45 65.5,92.97 v64.09,91.55 57.55,85.01 54.9,85.01 53.22,83.33 53.22,79.62 45.17,71.58 45.17,71.22 J1.5
RFANT
  Top 0.457: B1.1 70.03,97.99 | 70.03,97.99 A1.FEED | 70.03,97.99 70.03,98.44 C9.2
RFN
  Top 0.2: U2.9 69.11,95.3 B1.3
RFP
  Top 0.2: U2.8 69.47,94.95 B1.4
RX0  (via drill 0.38)
  Top 0.152: v61.61,70.87 58.08,74.4 58.08,79.88 58.7,80.5 U2.46
  Bottom 0.152: v61.61,70.87 61.61,62.91 81.41,43.11 87.69,49.39 91.76,49.39 100.68,58.32 102.45,58.32 JP1.TXO
RX1  (via drill 0.38)
  Top 0.152: v44.56,79.62 54.1,89.16 55.16,89.16 55.78,88.55 U2.27
  Bottom 0.152: v44.56,79.62 44.56,78.73 34.04,68.22 33.51,68.22 32.54,67.24 32.54,56.81 34.92,54.43 36.07,55.58 44.73,55.58 67.18,33.13 JP2.TXO
SCK  (via drill 0.38)
  Top 0.152: v54.1,82.98 54.63,82.98 55.43,83.77 U2.37
  Bottom 0.152: v54.1,82.98 54.1,79.8 46.32,72.02 46.32,69.9 45.09,68.66 J1.3
SCL  (via drill 0.38)
  Top 0.152: LSM9DS1.2 60.55,67.54 R12.1 60.02,68.04 v54.63,73.43 | v55.16,90.58 56.49,89.25 U2.25 | v47.74,69.9 37.84,69.9 34.13,73.61 33.42,73.61 32.89,74.14 32.89,78.56 34.04,79.71 J2.1
  Bottom 0.152: v55.16,90.58 44.73,90.58 J2.1 | v54.63,73.43 51.27,73.43 v47.74,69.9
SDA  (via drill 0.38)
  Top 0.152: 66.62,66.22 R13.1 | v48.62,89.52 55.52,89.52 56.13,88.9 U2.26 | v39.34,82.36 54.72,66.98 63.91,66.98 64.62,66.27 R13.1
  Top 0.2: LSM9DS1.4 67.33,66.93 66.62,66.22 | R13.1
  Bottom 0.152: v48.62,89.52 46.5,89.52 v39.34,82.36 34.21,77.23 34.04,77.23 J2.2
TX0  (via drill 0.38)
  Top 0.152: v61.88,75.55 58.43,79 58.43,79.53 59.05,80.15 U2.47 | v68.95,72.19 70.01,71.13 86.63,71.13 93.43,64.33 93.43,57.79 94.05,57.17 94.76,57.17 95.56,57.96 99.8,57.96 101.92,55.84 JP1.RXI
  Bottom 0.152: v61.88,75.55 65.24,75.55 68.77,72.02 v68.95,72.19
TX1  (via drill 0.38)
  Top 0.152: v45.53,78.65 45.53,79.71 54.63,88.81 54.81,88.81 55.43,88.19 U2.28 | v47.65,59.2 53.75,53.1 53.75,44.26 64.8,33.21 JP2.RXI
  Bottom 0.152: v45.53,78.65 45.53,75.82 41.37,71.66 41.37,65.48 v47.65,59.2
V_BAT  (via drill 0.6)
  Top 0.457: J3.1 86.16,62.37 C4.1 86.16,59.34 U$6.3 | U$6.1 90.83,58.47 v91.15,58.79 | C16.1 92.43,98.67 v93.7,98.67 96.44,98.67 D1.C 96.86,98.86 U$1.V+ | U$3.V+ 99.47,39.73 D3.C 98.03,41.41 C10.1 99.99,47.38 v99.99,47.41 | v46.96,37.37 46.96,37.62 C7.1 42.58,40.11 D4.C 39.84,37.61 U$4.V+ | J2.8 33.91,61.98 v31.4,61.98 | v36.57,89.2 36.82,89.2 C13.1 39.17,95.56 D2.C 35.01,99.71 U$2.V+
  Bottom 0.457: D5.C 103.67,82.7 v103.67,81.49 | D7.C 86.71,36.45 v87.48,36.45 | D6.C 37.63,50.27 v37.63,49.81 | D8.C 48.92,100.3 v46.39,100.3
  pour Route2: 12.03,68.48 45.97,102.42 52.33,96.06 41.02,84.74 36.78,73.43 37.7,60.21 46.68,50.66 54.21,43.34 63.65,36.66 76.73,38.29 87.76,45.64 94.83,52.85 78.21,68.98 91.83,82.66 84.26,90.37 82.46,92.24 91.93,101.72 125.17,68.48 68.6,11.91

### Text on the board
tPlace: TR | TL | SCL | SDA | PTL | PTR | PBL | PBR | GND | 3V | VBAT | RXO | BGND | RXI | GND | DTR | BR | RXI | TXO | GND | BL
bPlace: CSE 190 Quad v0 / Brian Henriquez / Jason Lam